# EAGLE schematic Microcontroller (EAGLE 6.4)
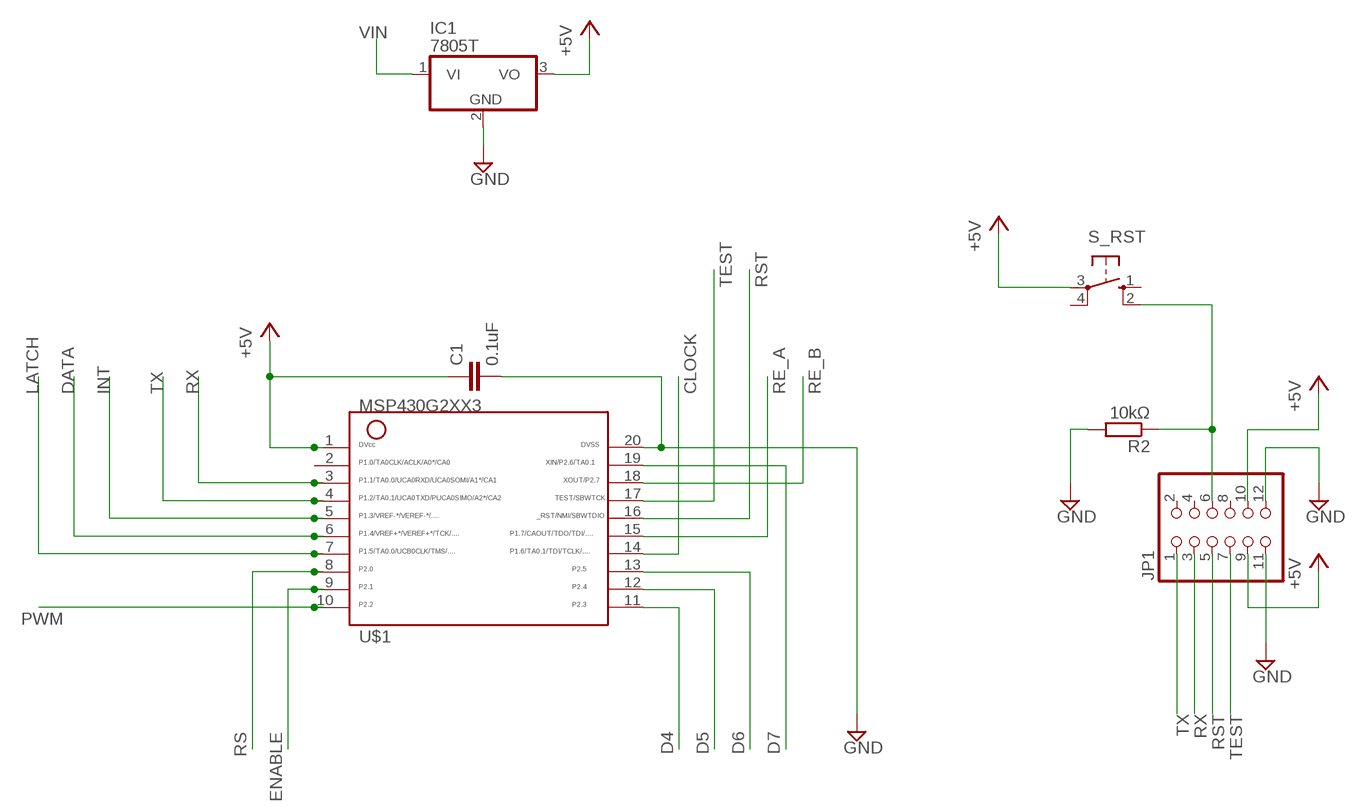
[diagram p0: schematic, sheet 1]

## Parts
C1  0.1uF  C-EU025-025X050  [C025-025X050]
IC1  7805T  [TO220H]
JP1  PINHD-2X6  [2X06]
R2  10kΩ  R-EU_0207/10  [0207/10]
S_RST  10-XX  [B3F-10XX]
U$1  G2XX3---N20  [N20]

## Nets
+5V: C1.1 IC1.3(VO) JP1.9 JP1.10 S_RST.3(P) U$1.1
CLOCK: U$1.14
D4: U$1.11
D5: U$1.12
D6: U$1.13
D7: U$1.19
DATA: U$1.6
ENABLE: U$1.9
GND: C1.2 IC1.2(GND) JP1.11 JP1.12 R2.2 U$1.20
INT: U$1.5
LATCH: U$1.7
N$3: JP1.6 R2.1 S_RST.2(S1)
PWM: U$1.10
RE_A: U$1.15
RE_B: U$1.18
RS: U$1.8
RST: JP1.5 U$1.16
RX: JP1.3 U$1.3
TEST: JP1.7 U$1.17
TX: JP1.1 U$1.4
VIN: IC1.1(VI)
Unconnected: JP1.2 JP1.4 JP1.8 S_RST.1(S) S_RST.4(P1) U$1.2

## Library data of the parts
C1 = rcl:C-EU: CAPACITOR, European symbol
IC1 = linear:78*: Positive VOLTAGE REGULATOR Source: http://cache.national.com/ds/LM/LM78L05.pdf http://www.fairchildsemi.com/ds/LM/LM7805.pdf
JP1 = pinhead:PINHD-2X6: PIN HEADER
R2 = resistor:R-EU_: RESISTOR, European symbol
S_RST = switch-omron:10-XX: OMRON SWITCH; MPN: B3F-1000; OC_FARNELL: 176432; OC_NEWARK: 36M3542
U$1 = TI_MSP430_v16:G2XX3---N20: MSP430G2XX1 PDIP (N) 20 Pin Package